# Altium schematic sheet CT.SchDoc
size A4
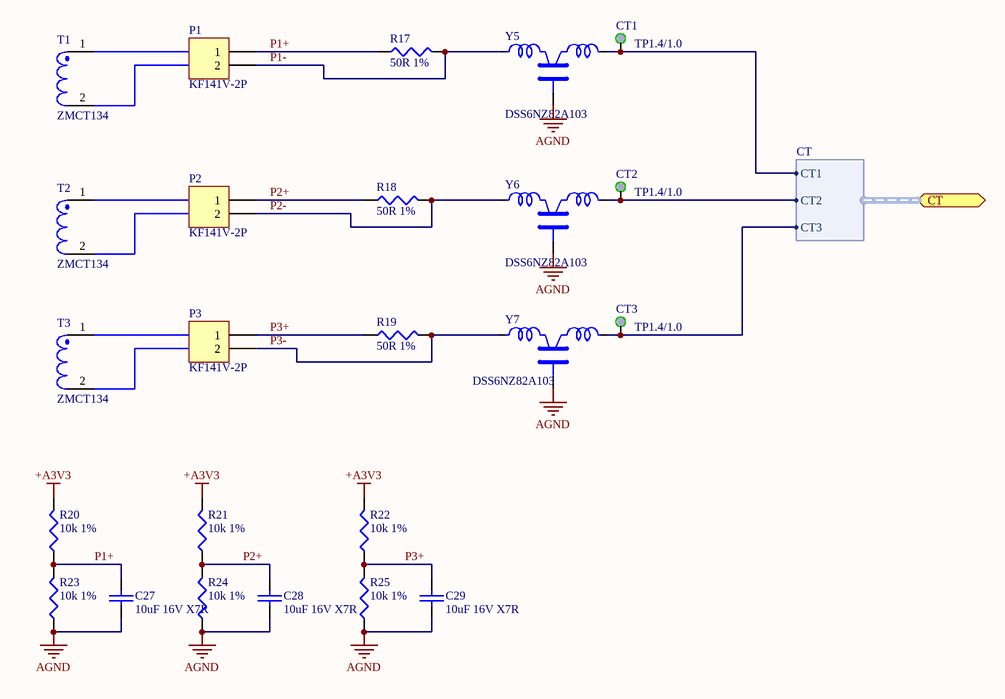
[diagram p0: CT.SchDoc]

## Parts
C27  10uF 16V X7R  [CAPC3216N]
C28  10uF 16V X7R  [CAPC3216N]
C29  10uF 16V X7R  [CAPC3216N]
CT1  TP1.4/1.0  [TP1.4/1.0]  (no BOM)
CT2  TP1.4/1.0  [TP1.4/1.0]  (no BOM)
CT3  TP1.4/1.0  [TP1.4/1.0]  (no BOM)
P1  KF141V-2P  [KF141V-2P]
P2  KF141V-2P  [KF141V-2P]
P3  KF141V-2P  [KF141V-2P]
R17  50R 1%  [RESC2012N]
R18  50R 1%  [RESC2012N]
R19  50R 1%  [RESC2012N]
R20  10k 1%  [RESC2012N]
R21  10k 1%  [RESC2012N]
R22  10k 1%  [RESC2012N]
R23  10k 1%  [RESC2012N]
R24  10k 1%  [RESC2012N]
R25  10k 1%  [RESC2012N]
T1  ZMCT134  (mechanical)
T2  ZMCT134  (mechanical)
T3  ZMCT134  (mechanical)
Y5  DSS6NZ82A103  [DSS6]
Y6  DSS6NZ82A103  [DSS6]
Y7  DSS6NZ82A103  [DSS6]

## Ports
CT (harness CT)

## Harnesses
CT: CT1, CT2, CT3

## Nets
+A3V3: R20.2 R21.2 R22.2
AGND: C27.1 C28.1 C29.1 R23.1 R24.1 R25.1 Y5.2 Y6.2 Y7.2
P1+: C27.2 P1.1 R17.1 R20.1 R23.2
P1-: P1.2 R17.2 Y5.1
P2+: C28.2 P2.1 R18.1 R21.1 R24.2
P2-: P2.2 R18.2 Y6.1
P3+: C29.2 P3.1 R19.1 R22.1 R25.2
P3-: P3.2 R19.2 Y7.1
NetCT1_1: CT1.1 Y5.3 ; port CT.CT1
NetCT2_1: CT2.1 Y6.3 ; port CT.CT2
NetCT3_1: CT3.1 Y7.3 ; port CT.CT3

Not connected (* = marked no-connect by the designer): T1 1 2; T2 1 2; T3 1 2

## Library data of the parts
C27-C29 = CAP: Price: 0.025
P1-P3 = Header 2: CT connector; LatestRevisionDate: 17-Jul-2002; LatestRevisionNote: Re-released for DXP Platform.; Publisher: Altium Limited
R17-R25 = Res3: Resistor; Value: 1K; Published: 8-Jun-2000; LatestRevisionDate: 29-May-2009; LatestRevisionNote: IPC-7351 Footprint Added.; PackageReference: J1-0603; Publisher: Altium Limited; PackageDescription: Chip Resistor
T1-T3 = CURRENT_TRANS: Current transformer
Y5-Y7 = DSS6: Murata EMI suppression filter; Manufacturer: Murata; Price: 0.5